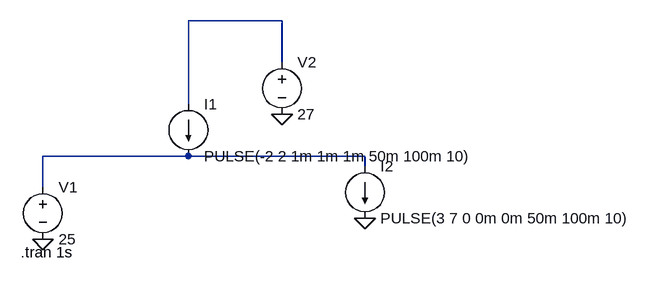
[diagram p0: schematic current sharing.asc]
current sharing.asc, the LTspice schematic file:
Version 4
SHEET 1 960 680
WIRE 400 -112 256 -112
WIRE 400 -48 400 -112
WIRE 256 16 256 -112
WIRE 256 96 32 96
WIRE 528 96 256 96
WIRE 528 112 528 96
WIRE 32 144 32 96
FLAG 528 192 0
FLAG 400 32 0
FLAG 32 224 0
SYMBOL voltage 32 128 R0
WINDOW 123 0 0 Left 0
WINDOW 39 0 0 Left 0
SYMATTR InstName V1
SYMATTR Value 25
SYMBOL current 256 16 R0
WINDOW 123 0 0 Left 0
WINDOW 39 0 0 Left 0
SYMATTR InstName I1
SYMATTR Value PULSE(-2 2 1m 1m 1m 50m 100m 10)
SYMBOL voltage 400 -64 R0
WINDOW 123 0 0 Left 0
WINDOW 39 0 0 Left 0
SYMATTR InstName V2
SYMATTR Value 27
SYMBOL current 528 112 R0
WINDOW 123 0 0 Left 0
WINDOW 39 0 0 Left 0
SYMATTR InstName I2
SYMATTR Value PULSE(3 7 0 0m 0m 50m 100m 10)
TEXT -2 244 Left 2 !.tran 1s

The netlist it stands for:
* current sharing.asc
V1 N002 0 25
I1 N001 N002 PULSE(-2 2 1m 1m 1m 50m 100m 10)
V2 N001 0 27
I2 N002 0 PULSE(3 7 0 0m 0m 50m 100m 10)
.tran 1s
.backanno
.end